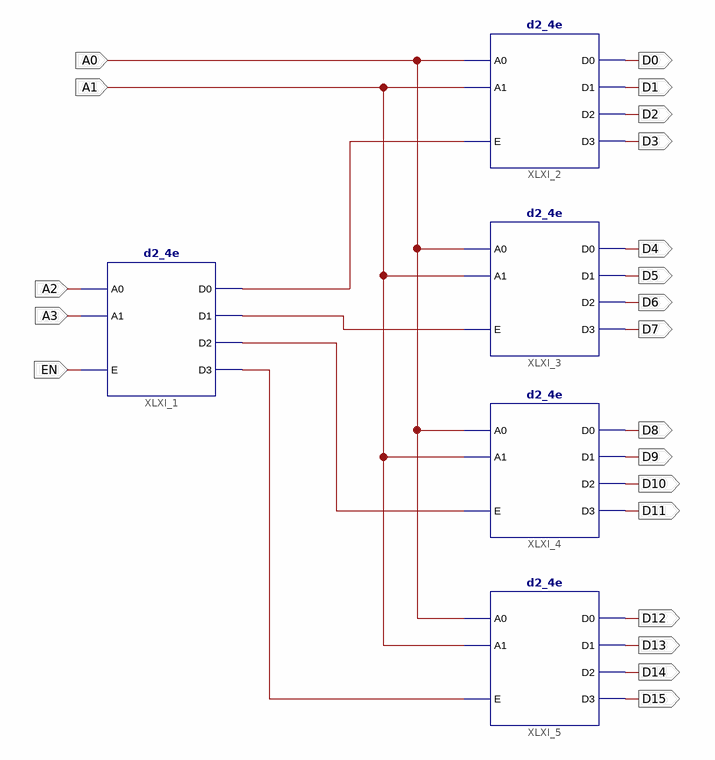
[diagram p0: schematic sheet 1]
// Xilinx ISE schematic C3_29.sch (kintex7) as structural Verilog: 5 symbols, 21 ports
module C3_29 (
  input  A2,
  input  A3,
  input  EN,
  input  A0,
  input  A1,
  output D0,
  output D1,
  output D2,
  output D3,
  output D4,
  output D5,
  output D6,
  output D7,
  output D8,
  output D9,
  output D10,
  output D11,
  output D12,
  output D13,
  output D14,
  output D15
);

  wire XLXN_16, XLXN_19, XLXN_20, XLXN_21;

  d2_4e XLXI_1 (.A0(A2), .A1(A3), .E(EN), .D0(XLXN_19), .D1(XLXN_20), .D2(XLXN_21), .D3(XLXN_16));
  d2_4e XLXI_2 (.A0(A0), .A1(A1), .E(XLXN_19), .D0(D0), .D1(D1), .D2(D2), .D3(D3));
  d2_4e XLXI_3 (.A0(A0), .A1(A1), .E(XLXN_20), .D0(D4), .D1(D5), .D2(D6), .D3(D7));
  d2_4e XLXI_4 (.A0(A0), .A1(A1), .E(XLXN_21), .D0(D8), .D1(D9), .D2(D10), .D3(D11));
  d2_4e XLXI_5 (.A0(A0), .A1(A1), .E(XLXN_16), .D0(D12), .D1(D13), .D2(D14), .D3(D15));
endmodule
